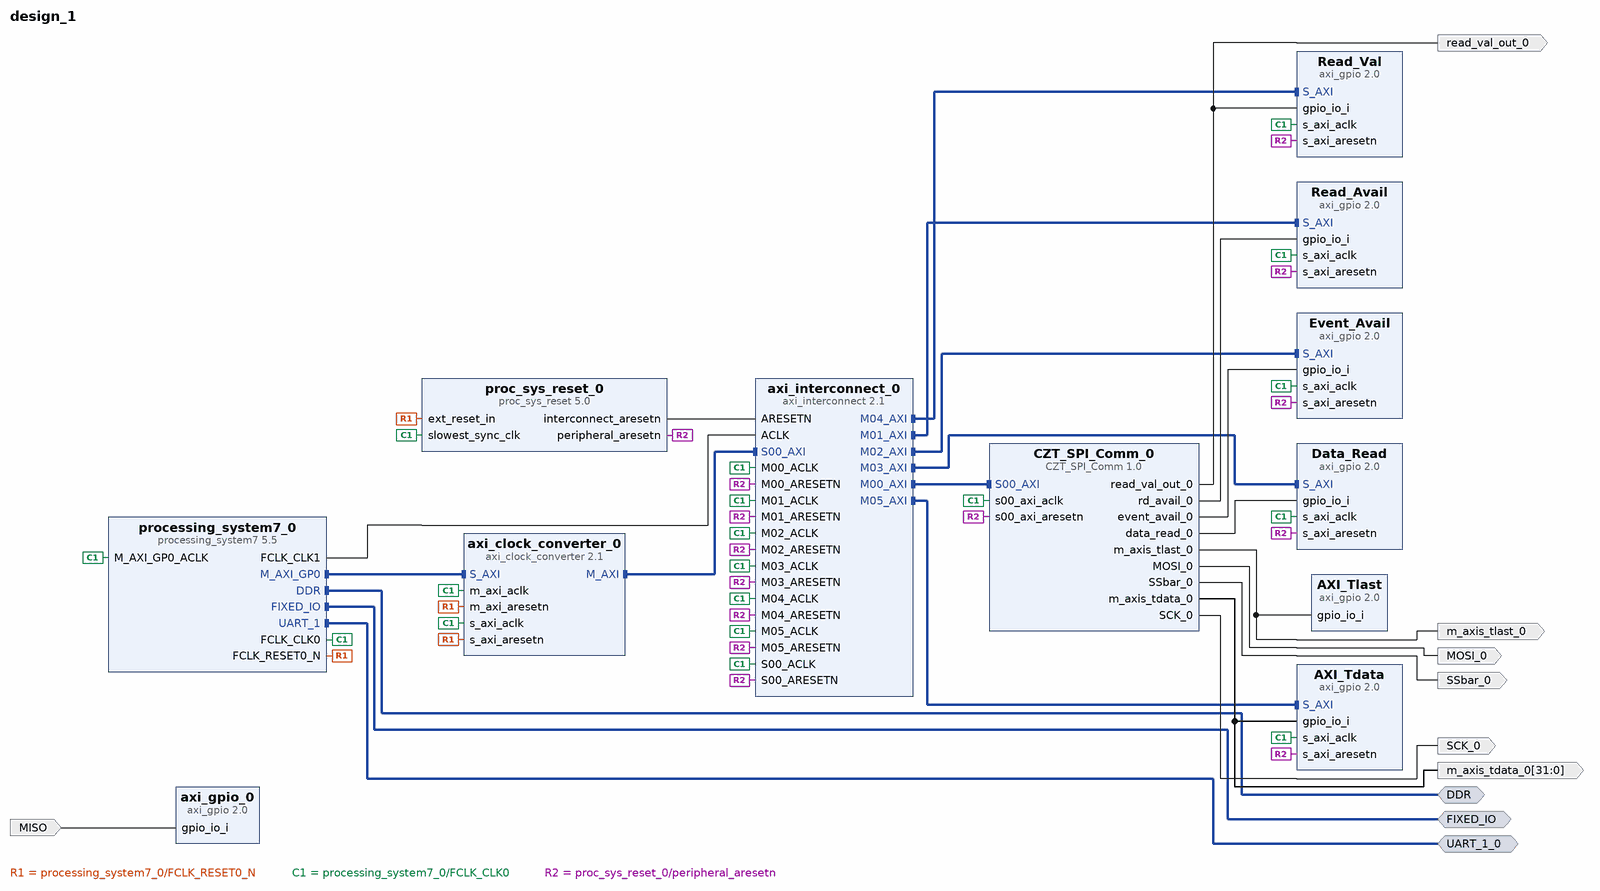
[diagram p0: block diagram of the top level]
# Vivado block design design_1, xc7z010clg400-1, Vivado 2019.1
create_bd_design design_1

create_bd_intf_port -mode Master -vlnv xilinx.com:interface:ddrx_rtl:1.0 DDR
create_bd_intf_port -mode Master -vlnv xilinx.com:display_processing_system7:fixedio_rtl:1.0 FIXED_IO
create_bd_intf_port -mode Master -vlnv xilinx.com:interface:uart_rtl:1.0 UART_1_0
create_bd_port -dir O SSbar_0
create_bd_port -dir O MOSI_0
create_bd_port -dir O SCK_0
create_bd_port -dir O read_val_out_0
create_bd_port -dir O m_axis_tlast_0
create_bd_port -dir O -from 31 -to 0 m_axis_tdata_0
create_bd_port -dir I MISO

create_bd_cell -type ip -vlnv iitb.ac.in:Hrishikesh:CZT_SPI_Comm:1.0 CZT_SPI_Comm_0
create_bd_cell -type ip -vlnv xilinx.com:ip:axi_gpio:2.0 Read_Avail
set_property -dict {CONFIG.C_ALL_INPUTS 1 CONFIG.C_GPIO_WIDTH 1} [get_bd_cells Read_Avail]
create_bd_cell -type ip -vlnv xilinx.com:ip:axi_gpio:2.0 Event_Avail
set_property -dict {CONFIG.C_ALL_INPUTS 1 CONFIG.C_GPIO_WIDTH 1} [get_bd_cells Event_Avail]
create_bd_cell -type ip -vlnv xilinx.com:ip:axi_gpio:2.0 Data_Read
set_property -dict {CONFIG.C_ALL_INPUTS 1 CONFIG.C_GPIO_WIDTH 32} [get_bd_cells Data_Read]
create_bd_cell -type ip -vlnv xilinx.com:ip:axi_gpio:2.0 AXI_Tdata
set_property -dict {CONFIG.C_ALL_INPUTS 1 CONFIG.C_GPIO_WIDTH 32} [get_bd_cells AXI_Tdata]
create_bd_cell -type ip -vlnv xilinx.com:ip:axi_gpio:2.0 Read_Val
set_property -dict {CONFIG.C_ALL_INPUTS 1 CONFIG.C_GPIO_WIDTH 1} [get_bd_cells Read_Val]
create_bd_cell -type ip -vlnv xilinx.com:ip:axi_gpio:2.0 AXI_Tlast
set_property -dict {CONFIG.C_ALL_INPUTS 1 CONFIG.C_GPIO_WIDTH 1} [get_bd_cells AXI_Tlast]
create_bd_cell -type ip -vlnv xilinx.com:ip:axi_gpio:2.0 axi_gpio_0
set_property -dict {CONFIG.C_ALL_INPUTS 1 CONFIG.C_GPIO_WIDTH 1} [get_bd_cells axi_gpio_0]
create_bd_cell -type ip -vlnv xilinx.com:ip:processing_system7:5.5 processing_system7_0
set_property -dict [list \
  CONFIG.PCW_APU_PERIPHERAL_FREQMHZ 667 \
  CONFIG.PCW_ENET0_PERIPHERAL_ENABLE 0 \
  CONFIG.PCW_ENET0_RESET_ENABLE 0 \
  CONFIG.PCW_ENET_RESET_ENABLE 1 \
  CONFIG.PCW_EN_CLK1_PORT 1 \
  CONFIG.PCW_FCLK_CLK1_BUF TRUE \
  CONFIG.PCW_FPGA1_PERIPHERAL_FREQMHZ 10 \
  CONFIG.PCW_FPGA_FCLK1_ENABLE 1 \
  CONFIG.PCW_GPIO_EMIO_GPIO_ENABLE 1 \
  CONFIG.PCW_GPIO_EMIO_GPIO_IO 64 \
  CONFIG.PCW_GPIO_MIO_GPIO_ENABLE 1 \
  CONFIG.PCW_GPIO_MIO_GPIO_IO MIO \
  CONFIG.PCW_I2C_RESET_ENABLE 0 \
  CONFIG.PCW_PRESET_BANK1_VOLTAGE {LVCMOS 1.8V} \
  CONFIG.PCW_QSPI_PERIPHERAL_ENABLE 0 \
  CONFIG.PCW_SD0_PERIPHERAL_ENABLE 0 \
  CONFIG.PCW_SDIO_PERIPHERAL_FREQMHZ 50 \
  CONFIG.PCW_UART1_PERIPHERAL_ENABLE 1 \
  CONFIG.PCW_UART1_UART1_IO EMIO \
  CONFIG.PCW_UART_PERIPHERAL_FREQMHZ 100 \
  CONFIG.PCW_UIPARAM_DDR_FREQ_MHZ 533.333333 \
  CONFIG.PCW_UIPARAM_DDR_MEMORY_TYPE {DDR 3 (Low Voltage)} \
  CONFIG.PCW_UIPARAM_DDR_PARTNO {MT41K256M16 RE-125} \
  CONFIG.PCW_USB0_PERIPHERAL_ENABLE 0 \
  CONFIG.PCW_USB0_RESET_ENABLE 1 \
  CONFIG.PCW_USB0_RESET_IO {MIO 46} \
  CONFIG.PCW_USB_RESET_ENABLE 1 \
] [get_bd_cells processing_system7_0]
# 295 more settings of processing_system7_0 are not shown: defaults, MIO pin electricals, DDR timing, and values the tool derives
create_bd_cell -type ip -vlnv xilinx.com:ip:axi_clock_converter:2.1 axi_clock_converter_0
create_bd_cell -type ip -vlnv xilinx.com:ip:proc_sys_reset:5.0 proc_sys_reset_0
create_bd_cell -type ip -vlnv xilinx.com:ip:axi_interconnect:2.1 axi_interconnect_0
set_property -dict {CONFIG.NUM_MI 6} [get_bd_cells axi_interconnect_0]

# ---- connections ----

connect_bd_intf_net [get_bd_intf_pins processing_system7_0/M_AXI_GP0] [get_bd_intf_pins axi_clock_converter_0/S_AXI]
connect_bd_intf_net [get_bd_intf_ports DDR] [get_bd_intf_pins processing_system7_0/DDR]
connect_bd_intf_net [get_bd_intf_ports FIXED_IO] [get_bd_intf_pins processing_system7_0/FIXED_IO]
connect_bd_intf_net [get_bd_intf_pins axi_clock_converter_0/M_AXI] [get_bd_intf_pins axi_interconnect_0/S00_AXI]
connect_bd_intf_net [get_bd_intf_pins axi_interconnect_0/M00_AXI] [get_bd_intf_pins CZT_SPI_Comm_0/S00_AXI]
connect_bd_intf_net [get_bd_intf_pins Read_Avail/S_AXI] [get_bd_intf_pins axi_interconnect_0/M01_AXI]
connect_bd_intf_net [get_bd_intf_ports UART_1_0] [get_bd_intf_pins processing_system7_0/UART_1]
connect_bd_intf_net [get_bd_intf_pins Data_Read/S_AXI] [get_bd_intf_pins axi_interconnect_0/M03_AXI]
connect_bd_intf_net [get_bd_intf_pins AXI_Tdata/S_AXI] [get_bd_intf_pins axi_interconnect_0/M05_AXI]
connect_bd_intf_net [get_bd_intf_pins Event_Avail/S_AXI] [get_bd_intf_pins axi_interconnect_0/M02_AXI]
connect_bd_intf_net [get_bd_intf_pins Read_Val/S_AXI] [get_bd_intf_pins axi_interconnect_0/M04_AXI]
connect_bd_net [get_bd_pins CZT_SPI_Comm_0/SSbar_0] [get_bd_ports SSbar_0]
connect_bd_net [get_bd_pins CZT_SPI_Comm_0/MOSI_0] [get_bd_ports MOSI_0]
connect_bd_net [get_bd_pins CZT_SPI_Comm_0/SCK_0] [get_bd_ports SCK_0]
connect_bd_net [get_bd_pins CZT_SPI_Comm_0/rd_avail_0] [get_bd_pins Read_Avail/gpio_io_i]
connect_bd_net [get_bd_pins CZT_SPI_Comm_0/event_avail_0] [get_bd_pins Event_Avail/gpio_io_i]
connect_bd_net [get_bd_pins CZT_SPI_Comm_0/data_read_0] [get_bd_pins Data_Read/gpio_io_i]
connect_bd_net [get_bd_pins CZT_SPI_Comm_0/m_axis_tdata_0] [get_bd_pins AXI_Tdata/gpio_io_i] [get_bd_ports m_axis_tdata_0]
connect_bd_net [get_bd_pins CZT_SPI_Comm_0/read_val_out_0] [get_bd_pins Read_Val/gpio_io_i] [get_bd_ports read_val_out_0]
connect_bd_net [get_bd_pins CZT_SPI_Comm_0/m_axis_tlast_0] [get_bd_pins AXI_Tlast/gpio_io_i] [get_bd_ports m_axis_tlast_0]
connect_bd_net [get_bd_ports MISO] [get_bd_pins axi_gpio_0/gpio_io_i]
connect_bd_net [get_bd_pins processing_system7_0/FCLK_RESET0_N] \
  [get_bd_pins axi_clock_converter_0/s_axi_aresetn] [get_bd_pins axi_clock_converter_0/m_axi_aresetn] \
  [get_bd_pins proc_sys_reset_0/ext_reset_in]
connect_bd_net [get_bd_pins processing_system7_0/FCLK_CLK0] \
  [get_bd_pins proc_sys_reset_0/slowest_sync_clk] [get_bd_pins axi_clock_converter_0/s_axi_aclk] \
  [get_bd_pins processing_system7_0/M_AXI_GP0_ACLK] [get_bd_pins CZT_SPI_Comm_0/s00_axi_aclk] \
  [get_bd_pins axi_interconnect_0/M00_ACLK] [get_bd_pins Read_Avail/s_axi_aclk] [get_bd_pins axi_interconnect_0/M01_ACLK] \
  [get_bd_pins Event_Avail/s_axi_aclk] [get_bd_pins axi_interconnect_0/M02_ACLK] [get_bd_pins Data_Read/s_axi_aclk] \
  [get_bd_pins axi_interconnect_0/M03_ACLK] [get_bd_pins AXI_Tdata/s_axi_aclk] [get_bd_pins axi_interconnect_0/M05_ACLK] \
  [get_bd_pins Read_Val/s_axi_aclk] [get_bd_pins axi_interconnect_0/M04_ACLK] [get_bd_pins axi_clock_converter_0/m_axi_aclk] \
  [get_bd_pins axi_interconnect_0/S00_ACLK]
connect_bd_net [get_bd_pins proc_sys_reset_0/interconnect_aresetn] [get_bd_pins axi_interconnect_0/ARESETN]
connect_bd_net [get_bd_pins processing_system7_0/FCLK_CLK1] [get_bd_pins axi_interconnect_0/ACLK]
connect_bd_net [get_bd_pins proc_sys_reset_0/peripheral_aresetn] \
  [get_bd_pins axi_interconnect_0/S00_ARESETN] [get_bd_pins axi_interconnect_0/M00_ARESETN] \
  [get_bd_pins axi_interconnect_0/M01_ARESETN] [get_bd_pins CZT_SPI_Comm_0/s00_axi_aresetn] \
  [get_bd_pins Read_Avail/s_axi_aresetn] [get_bd_pins Event_Avail/s_axi_aresetn] [get_bd_pins axi_interconnect_0/M02_ARESETN] \
  [get_bd_pins Data_Read/s_axi_aresetn] [get_bd_pins axi_interconnect_0/M03_ARESETN] [get_bd_pins AXI_Tdata/s_axi_aresetn] \
  [get_bd_pins axi_interconnect_0/M05_ARESETN] [get_bd_pins Read_Val/s_axi_aresetn] \
  [get_bd_pins axi_interconnect_0/M04_ARESETN]

validate_bd_design
save_bd_design
